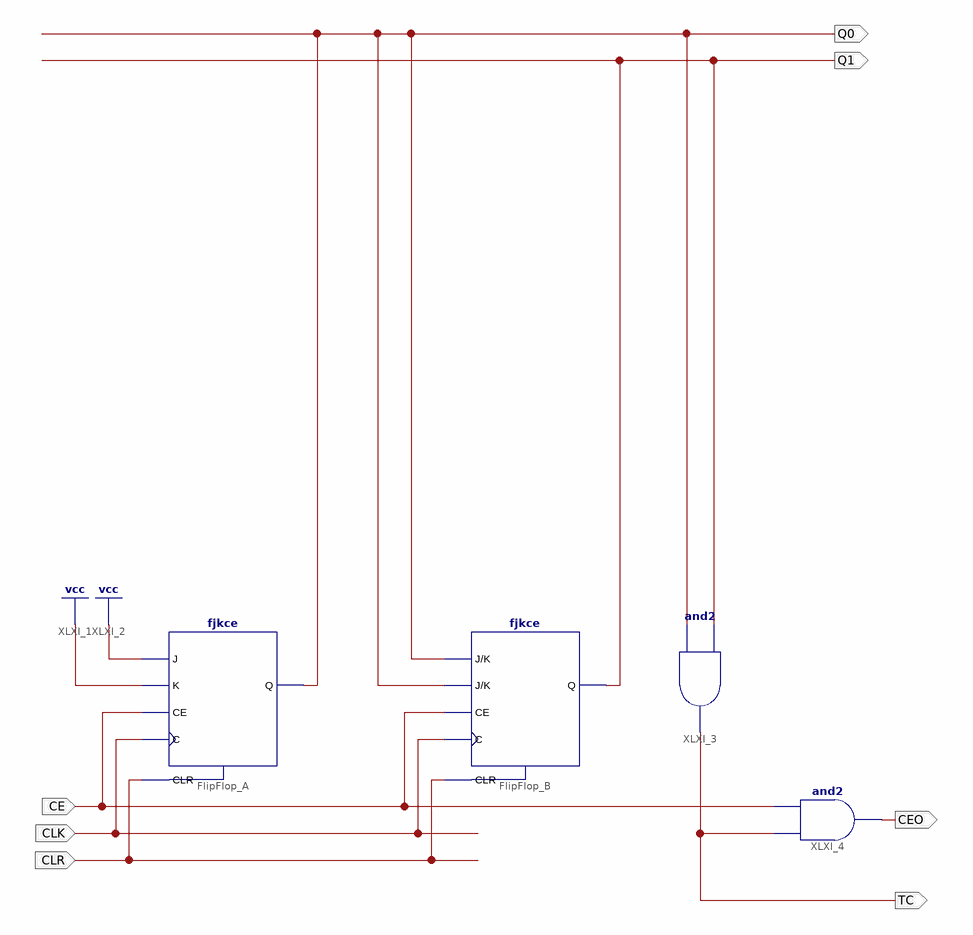
[diagram p0: schematic sheet 1]
// Xilinx ISE schematic counters0.sch (spartan6) as structural Verilog: 4 symbols, 7 ports
module counters0 (
  input  CE,
  input  CLK,
  input  CLR,
  output CEO,
  output TC,
  output Q0,
  output Q1
);

  fjkce FlipFlop_A (.C(CLK), .CE(CE), .CLR(CLR), .J(1'b1), .K(1'b1), .Q(Q0));
  fjkce FlipFlop_B (.C(CLK), .CE(CE), .CLR(CLR), .J(Q0), .K(Q0), .Q(Q1));
  and XLXI_3 (TC, Q0, Q1);
  and XLXI_4 (CEO, CE, TC);
endmodule
